# Altium schematic sheet Master control circuit.SchDoc: 电动汽车电池管理系统
size A4; Address1: 先进成图技术赛道国赛试题; Address2: 陈大勇; Address3: 000000000000000000; Address4: DZ001; SheetNumber: 1; SheetTotal: 4
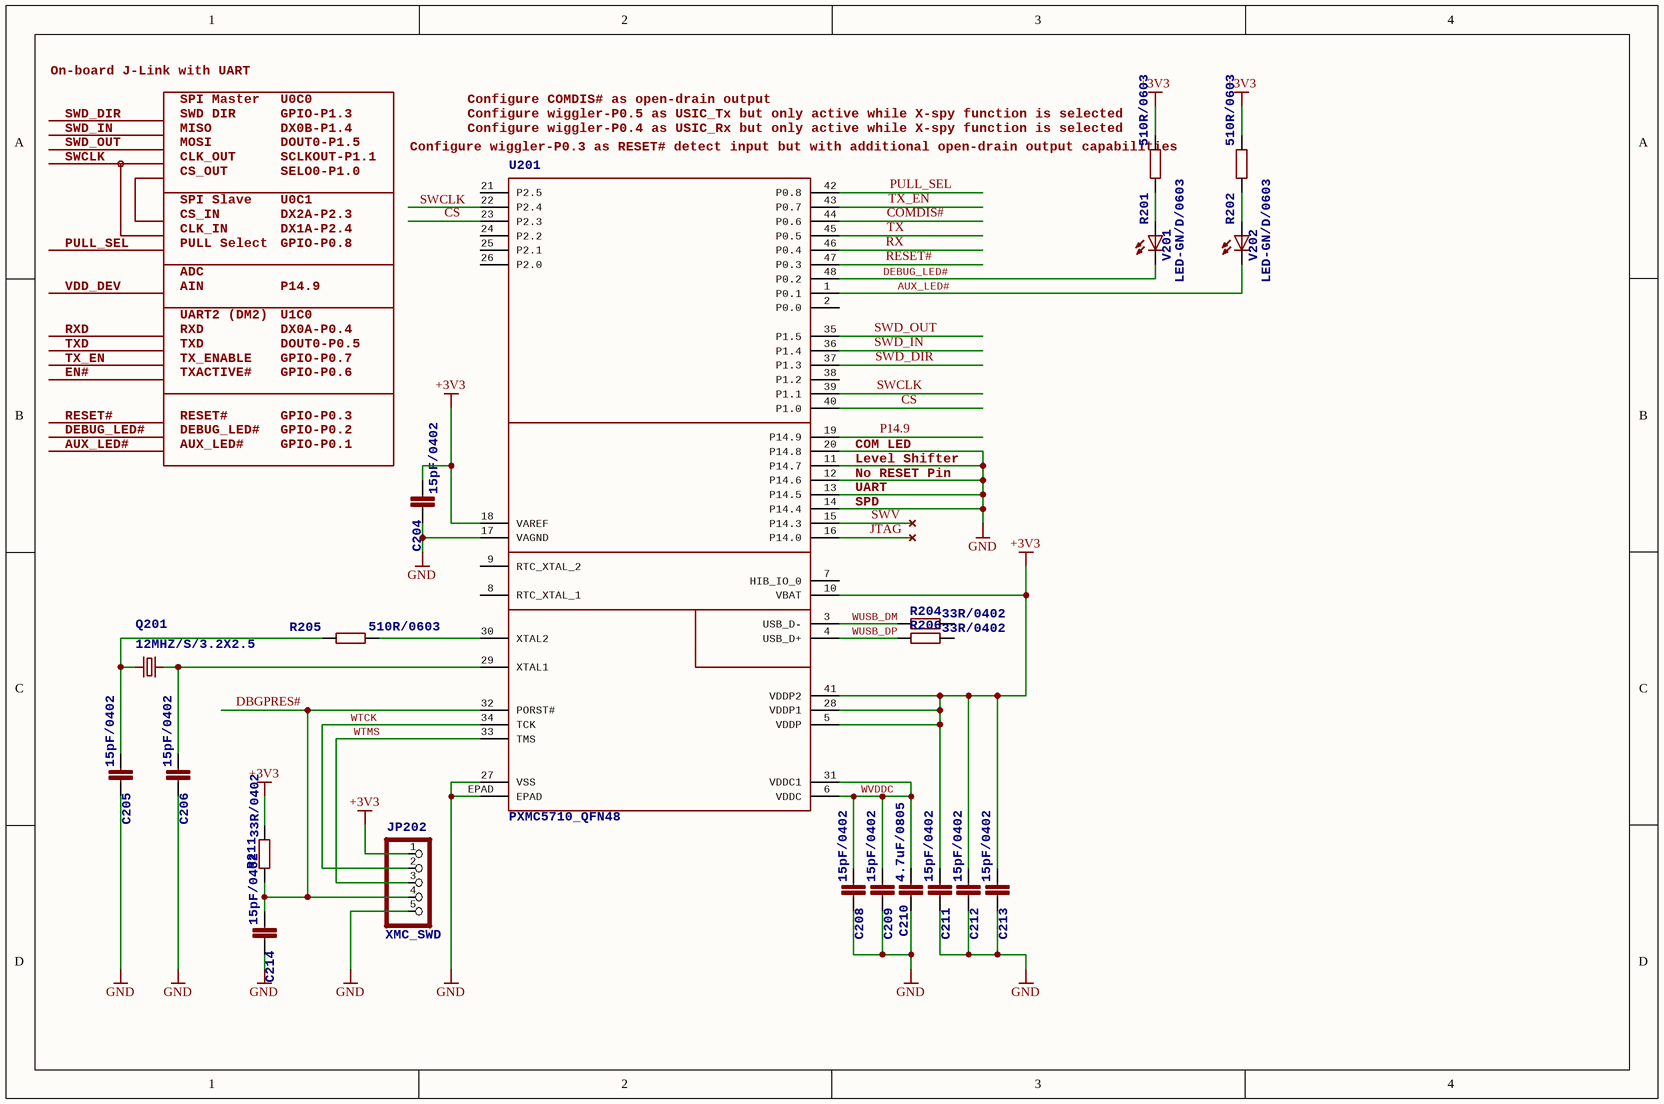
[diagram p0: Master control circuit.SchDoc]

## Parts
C204  15pF/0402  [C0402]
C205  15pF/0402  [C0402]
C206  15pF/0402  [C0402]
C208  15pF/0402  [C0402]
C209  15pF/0402  [C0402]
C210  4.7uF/0805  [C0805K]
C211  15pF/0402  [C0402]
C212  15pF/0402  [C0402]
C213  15pF/0402  [C0402]
C214  15pF/0402  [C0402]
JP202  XMC_SWD  [1X05]
Q201  12MHZ/S/3.2X2.5  [32X25_2PAD]
R201  510R/0603  [R0603]
R202  510R/0603  [R0603]
R204  33R/0402  [R0402]
R205  510R/0603  [R0603]
R206  33R/0402  [R0402]
R211  33R/0402  [R0402]
U201  PXMC5710_QFN48  [QFN-48-7X7]
V201  LED-GN/D/0603  [CHIPLED_0603]
V202  LED-GN/D/0603  [CHIPLED_0603]

## Nets
+3V3: C204.1 C211.1 C212.1 C213.1 JP202.1 R201.1 R202.1 R211.2 U201.5(VDDP) U201.10(VBAT) U201.18(VAREF) U201.28(VDDP1) U201.41(VDDP2)
GND: C204.2 C205.2 C206.2 C208.2 C209.2 C210.2 C211.2 C212.2 C213.2 C214.2 JP202.5 U201.11(P14.7) U201.12(P14.6) U201.13(P14.5) U201.14(P14.4) U201.17(VAGND) U201.20(P14.8) U201.27(VSS) U201.EPAD
AUX_LED#: U201.1(P0.1) V202.C
COMDIS#: U201.44(P0.6)
CS: U201.23(P2.3) U201.40(P1.0)
DBGPRES#: C214.1 JP202.4 R211.1 U201.32(PORST#)
DEBUG_LED#: U201.48(P0.2) V201.C
JTAG: U201.16(P14.0)
P14.9: U201.19(P14.9)
PULL_SEL: U201.42(P0.8)
RESET#: U201.47(P0.3)
RX: U201.46(P0.4)
SWCLK: U201.39(P1.1)
SWD_DIR: U201.37(P1.3)
SWD_IN: U201.36(P1.4)
SWD_OUT: U201.35(P1.5)
SWV: U201.15(P14.3)
TX: U201.45(P0.5)
TX_EN: U201.43(P0.7)
WTCK: JP202.2 U201.34(TCK)
WTMS: JP202.3 U201.33(TMS)
WUSB_DM: R204.1 U201.3(USB_D-)
WUSB_DP: R206.1 U201.4(USB_D+)
WVDDC: C208.1 C209.1 C210.1 U201.6(VDDC) U201.31(VDDC1)
NetC205_1: C205.1 Q201.2 R205.2
NetC206_1: C206.1 Q201.1 U201.29(XTAL1)
NetR201_2: R201.2 V201.A
NetR202_2: R202.2 V202.A
NetR205_1: R205.1 U201.30(XTAL2)

Not connected (* = marked no-connect by the designer): R204 2; R206 2; U201 2(P0.0) 7(HIB_IO_0) 8(RTC_XTAL_1) 9(RTC_XTAL_2) 21(P2.5) 22(P2.4) 24(P2.2) 25(P2.1) 26(P2.0) 38(P1.2)

## Notes on the sheet
- On-board J-Link with UART
- SWD_DIR
- SPI Master
- SWD DIR
- U0C0
- GPIO-P1.3
- Configure COMDIS# as open-drain output
- Configure wiggler-P0.5 as USIC_Tx but only active while X-spy function is selected
- SWD_OUT
- SWCLK
- SWD_IN
- MOSI
- CLK_OUT
- MISO
- CS_OUT
- SCLKOUT-P1.1
- DX0B-P1.4
- DOUT0-P1.5
- SELO0-P1.0
- (near U201) Configure wiggler-P0.3 as RESET# detect input but with additional open-drain output capabilities
- (near U201) Configure wiggler-P0.4 as USIC_Rx but only active while X-spy function is selected
- PULL_SEL
- SPI Slave
- CS_IN
- CLK_IN
- PULL Select
- U0C1
- DX2A-P2.3
- DX1A-P2.4
- GPIO-P0.8
- RXD
- VDD_DEV
- UART2 (DM2)
- ADC
- AIN
- DX0A-P0.4
- U1C0
- P14.9
- TXD
- EN#
- TX_EN
- TXACTIVE#
- TX_ENABLE
- DOUT0-P0.5
- GPIO-P0.6
- GPIO-P0.7
- RESET#
- DEBUG_LED#
- AUX_LED#
- GPIO-P0.3
- GPIO-P0.2
- GPIO-P0.1
- (near U201) No RESET Pin
- (near U201) Level Shifter
- (near U201) COM LED
- (near U201) UART
- (near U201) SPD
- Labels drawn without touching a wire or pin: SWCLK
- 项目名称
- 选手信息
- 当前日期
- 图页名称
- 当前时间
- 第           幅
- 共           幅

## Library data of the parts
C204-C206 C208 C209 C211-C214 = C-EUC0402
C210 = C-EUC0805K: CAPACITOR, European symbol
JP202 = PINHD-1X5: PIN HEADER
Q201 = NX3225_22PAD
R201 R202 R205 = R-EU_R0603
R204 R206 R211 = R-EU_R0402
U201 = XMC4200_QFN48
V201 V202 = LEDCHIPLED_0603: LED   OSRAM: - CHIPLED LG R971, LG N971, LY N971, LG Q971, LY Q971, LO R971, LY R971 LH N974, LH R974 LS Q976, LO Q976, LY Q976 LO Q996 - Hyper CHIPLED LW Q18S LB Q993, LB Q99A, LB R99A - SideLED LS A670, LO A670, LY A670, LG A670, LP A670 LB A673, LV A673, LT A673, LW A673 LH A674 LY A675 LS A676, LA A676, LO A676, LY A676, LW A676 LS A679, LY A679, LG A679 -  Hyper Micro SIDELED® LS Y876, LA Y876, LO Y876, LY Y876 LT Y87S - SmartLED LW L88C, LW L88S LB L89C, LB L89S, LG L890 LS L89K, LO L89K, LY L89K LS L896, LA L896, LO L896, LY L896 - TOPLED LS T670, LO T670, LY T670, LG T670, LP T670 LSG T670, LSP T670, LSY T670, LOP T670, LYG T670 LG T671, LOG T671, LSG T671 LB T673, LV T673, LT T673, LW T673 LH T674 LS T676, LA T676, LO T676, LY T676, LB T676, LH T676, LSB T676, LW T676 LB T67C, LV T67C, LT T67C, LS T67K, LO T67K, LY T67K, LW E67C LS E67B, LA E67B, LO E67B, LY E67B, LB E67C, LV E67C, LT E67C LW T67C LS T679, LY T679, LG T679 LS T770, LO T770, LY T770, LG T770, LP T770 LB T773, LV T773, LT T773, LW T773 LH T774 LS E675, LA E675, LY E675, LS T675 LS T776, LA T776, LO T776, LY T776, LB T776 LHGB T686 LT T68C, LB T68C - Hyper Mini TOPLED® LB M676 - Mini TOPLED Santana® LG M470 LS M47K, LO M47K, LY M47K    Source: http://www.osram.convergy.de   LUXEON: - LUMILED® LXK2-PW12-R00, LXK2-PW12-S00, LXK2-PW14-U00, LXK2-PW14-V00 LXK2-PM12-R00, LXK2-PM12-S00, LXK2-PM14-U00 LXK2-PE12-Q00, LXK2-PE12-R00, LXK2-PE12-S00, LXK2-PE14-T00, LXK2-PE14-U00 LXK2-PB12-K00, LXK2-PB12-L00, LXK2-PB12-M00, LXK2-PB14-N00, LXK2-PB14-P00, LXK2-PB14-Q00 LXK2-PR12-L00, LXK2-PR12-M00, LXK2-PR14-Q00, LXK2-PR14-R00 LXK2-PD12-Q00, LXK2-PD12-R00, LXK2-PD12-S00 LXK2-PH12-R00, LXK2-PH12-S00 LXK2-PL12-P00, LXK2-PL12-Q00, LXK2-PL12-R00    Source: www.luxeon.com   KINGBRIGHT:   KA-3528ASYC Source: www.kingbright.com